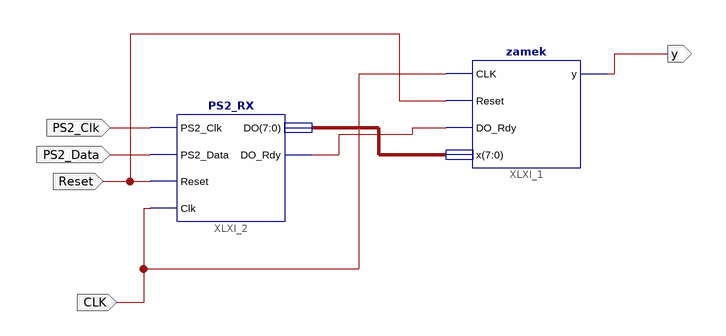
[diagram p0: schematic sheet 1]
// Xilinx ISE schematic zamek_schemat.sch (xc9500xl) as structural Verilog: 2 symbols, 5 ports
module zamek_schemat (
  input  CLK,
  input  Reset,
  input  PS2_Data,
  input  PS2_Clk,
  output y
);

  wire XLXN_2;
  wire [7:0] XLXN_1;

  zamek XLXI_1 (.CLK(CLK), .Reset(Reset), .DO_Rdy(XLXN_2), .x(XLXN_1), .y(y));
  PS2_RX XLXI_2 (.PS2_Clk(PS2_Clk), .PS2_Data(PS2_Data), .Clk(CLK), .Reset(Reset), .DO_Rdy(XLXN_2), .DO(XLXN_1));
endmodule
